# Altium project LHC_Clock.PrjPcb
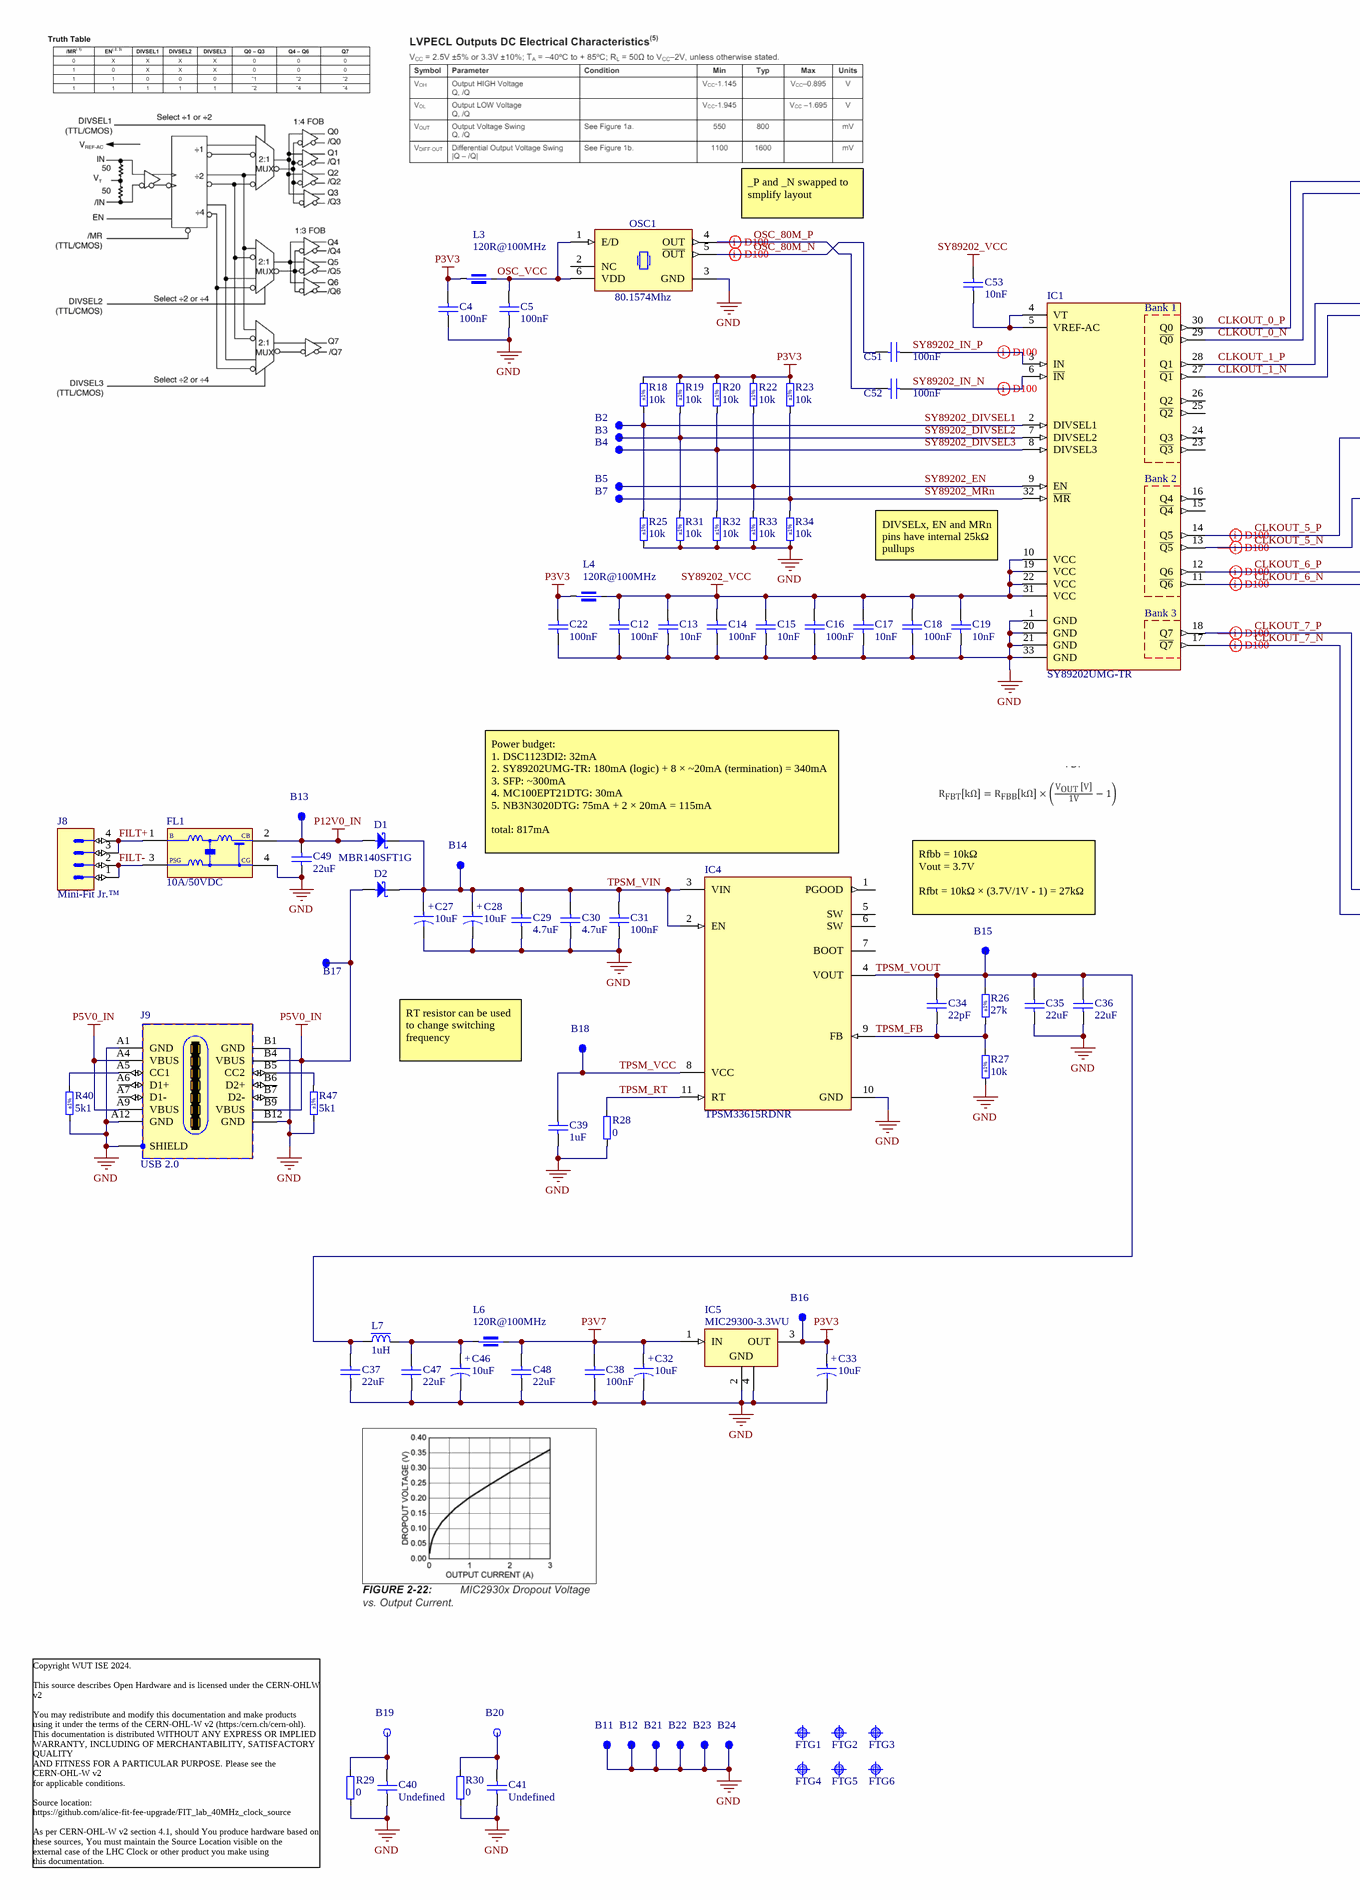
[diagram p0: LHC_Clock.SchDoc, left]
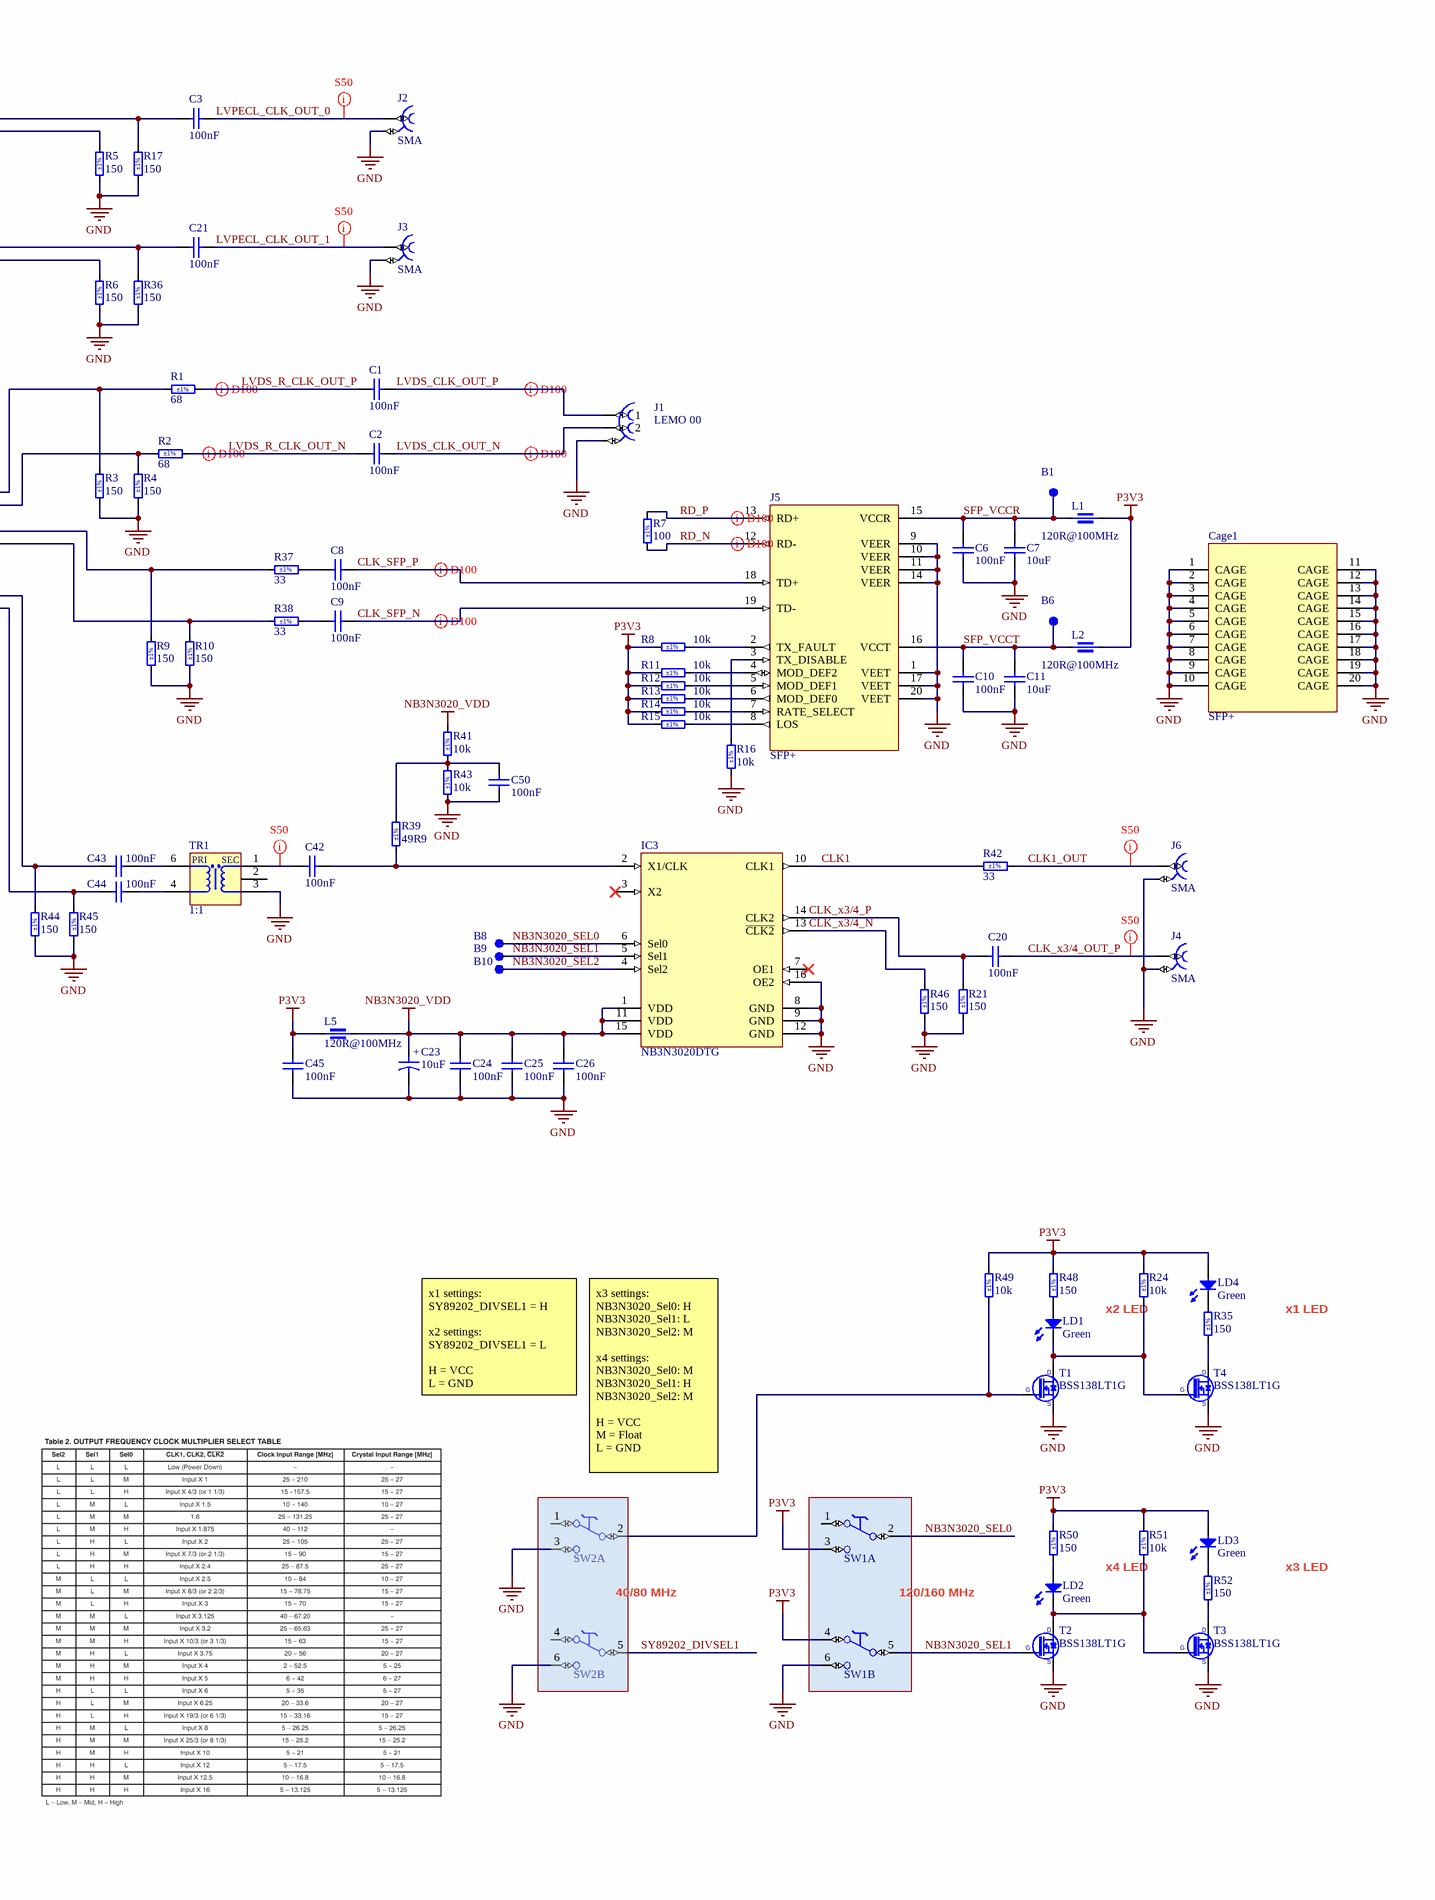
[diagram p1: LHC_Clock.SchDoc, right]
1 sheet, 170 parts. Net scope: global (net labels, ports and power ports of the same name join across sheets).
Board files: LHC_Clock.PcbDoc, PANEL-LHC_Clock.PcbDoc

## Sheet LHC_Clock.SchDoc: LHC clock
size A2; Author: M.Beldyga; CompanyName: WUT ISE; DrawnBy: M.Beldyga; Organization: WUT ISE; Address1: PW ISE; Address2: Nowowiejska 15/19 00-665 Warsaw; Address3: micbeldyga@gmail.com; Revision: 1.0; SheetNumber: 1; SheetTotal: 1; ModifiedBy: -; CheckedDate: -; DivGrp: WUT ISE; Designer: M.Beldyga; ModifiedDate: -; ProjectName: Sensor Box

### Parts
B1  SMD Pad  [C100]  (value not drawn)  (no BOM)
B2  SMD Pad  [C100]  (value not drawn)  (no BOM)
B3  SMD Pad  [C100]  (value not drawn)  (no BOM)
B4  SMD Pad  [C100]  (value not drawn)  (no BOM)
B5  SMD Pad  [C100]  (value not drawn)  (no BOM)
B6  SMD Pad  [C100]  (value not drawn)  (no BOM)
B7  SMD Pad  [C100]  (value not drawn)  (no BOM)
B8  SMD Pad  [C100]  (value not drawn)  (no BOM)
B9  SMD Pad  [C100]  (value not drawn)  (no BOM)
B10  SMD Pad  [C100]  (value not drawn)  (no BOM)
B11  SMD Pad  [C100]  (value not drawn)  (no BOM)
B12  SMD Pad  [C100]  (value not drawn)  (no BOM)
B13  SMD Pad  [C100]  (value not drawn)  (no BOM)
B14  SMD Pad  [C100]  (value not drawn)  (no BOM)
B15  SMD Pad  [C100]  (value not drawn)  (no BOM)
B16  SMD Pad  [C100]  (value not drawn)  (no BOM)
B17  SMD Pad  [C100]  (value not drawn)  (no BOM)
B18  SMD Pad  [C100]  (value not drawn)  (no BOM)
B19  Plated Hole  [MTG270_500]  (value not drawn)  (no BOM)
B20  Plated Hole  [MTG270_500]  (value not drawn)  (no BOM)
B21  SMD Pad  [C100]  (value not drawn)  (no BOM)
B22  SMD Pad  [C100]  (value not drawn)  (no BOM)
B23  SMD Pad  [C100]  (value not drawn)  (no BOM)
B24  SMD Pad  [C100]  (value not drawn)  (no BOM)
C1  100nF  [CAPC1005X55N]
C2  100nF  [CAPC1005X55N]
C3  100nF  [CAPC1005X55N]
C4  100nF  [CAPC1005X55N]
C5  100nF  [CAPC1005X55N]
C6  100nF  [CAPC1005X55N]
C7  10uF  [CAPC1608X80N]
C8  100nF  [CAPC1005X55N]
C9  100nF  [CAPC1005X55N]
C10  100nF  [CAPC1005X55N]
C11  10uF  [CAPC1608X80N]
C12  100nF  [CAPC1005X55N]
C13  10nF  [CAPC1005X55N]
C14  100nF  [CAPC1005X55N]
C15  10nF  [CAPC1005X55N]
C16  100nF  [CAPC1005X55N]
C17  10nF  [CAPC1005X55N]
C18  100nF  [CAPC1005X55N]
C19  10nF  [CAPC1005X55N]
C20  100nF  [CAPC1005X55N]
C21  100nF  [CAPC1005X55N]
C22  100nF  [CAPC1005X55N]
C23  10uF  [CAPMP3216X180N]
C24  100nF  [CAPC1005X55N]
C25  100nF  [CAPC1005X55N]
C26  100nF  [CAPC1005X55N]
C27  10uF  [CAPMP3216X180N]
C28  10uF  [CAPMP3216X180N]
C29  4.7uF  [CAPC1608X90N]
C30  4.7uF  [CAPC1608X90N]
C31  100nF  [CAPC1005X55N]
C32  10uF  [CAPMP3216X180N]
C33  10uF  [CAPMP3216X180N]
C34  22pF  [CAPC1005X55N]
C35  22uF  [CAPC2012X135N]
C36  22uF  [CAPC2012X135N]
C37  22uF  [CAPC2012X135N]
C38  100nF  [CAPC1005X55N]
C39  1uF  [CAPC1608X87N]
C40  Undefined  [CAPC2012X135N]
C41  Undefined  [CAPC2012X135N]
C42  100nF  [CAPC1005X55N]
C43  100nF  [CAPC1005X55N]
C44  100nF  [CAPC1005X55N]
C45  100nF  [CAPC1005X55N]
C46  10uF  [CAPMP3216X180N]
C47  22uF  [CAPC2012X135N]
C48  22uF  [CAPC2012X135N]
C49  22uF  [CAPC2012X135N]
C50  100nF  [CAPC1005X55N]
C51  100nF  [CAPC1005X55N]
C52  100nF  [CAPC1005X55N]
C53  10nF  [CAPC1005X55N]
Cage1  SFP+  [MOLEX_74737-0009]
D1  MBR140SFT1G  [SOD-123FL]
D2  MBR140SFT1G  [SOD-123FL]  (value not drawn)
FL1  10A/50VDC  [FIL_MURATA_BNX02]
FTG1  Use only in PCB  [FIDUCIAL_TOP_S100-200]  (value not drawn)  (no BOM)
FTG2  Use only in PCB  [FIDUCIAL_TOP_S100-200]  (value not drawn)  (no BOM)
FTG3  Use only in PCB  [FIDUCIAL_TOP_S100-200]  (value not drawn)  (no BOM)
FTG4  Use only in PCB  [FIDUCIAL_TOP_S100-200]  (value not drawn)  (no BOM)
FTG5  Use only in PCB  [FIDUCIAL_TOP_S100-200]  (value not drawn)  (no BOM)
FTG6  Use only in PCB  [FIDUCIAL_TOP_S100-200]  (value not drawn)  (no BOM)
IC1  SY89202UMG-TR  [QFN50P500X500X90_HS-33N]
IC3  NB3N3020DTG  [TSOP65P640X120-16N]
IC4  TPSM33615RDNR  [RDN0011A-MFG]
IC5  MIC29300-3.3WU  [TO254P1524X460-4N-S769X1066]
J1  LEMO 00  [LEMO_EPG.00.302.NLN]
J2  SMA  [AMPHENOL_132203-12]
J3  SMA  [MOLEX_73251-2120]
J4  SMA  [AMPHENOL_132203-12]
J5  SFP+  [MOLEX_74441-0001]
J6  SMA  [MOLEX_73251-2120]
J8  Mini-Fit Jr.™  [MOLEX_39-30-0040]
J9  USB 2.0  [MOLEX_216989-0001]
L1  120R@100MHz  [INDC1608X65N]
L2  120R@100MHz  [INDC1608X65N]
L3  120R@100MHz  [INDC1608X65N]
L4  120R@100MHz  [INDC1608X65N]
L5  120R@100MHz  [INDC1608X65N]
L6  120R@100MHz  [INDC1608X65N]
L7  1uH  [IND_COILCRAFT_PFL3215]
LD1  Green  [LED_AVAGO_HSME-C120]
LD2  Green  [LED_AVAGO_HSME-C120]
LD3  Green  [LED_AVAGO_HSME-C120]
LD4  Green  [LED_AVAGO_HSME-C120]
OSC1  80.1574Mhz  [OSC_MICROCHIP_DSC11x3D]
R1  68  Tolerance: ±1%  [RESC1005X40N]
R2  68  Tolerance: ±1%  [RESC1005X40N]
R3  150  Tolerance: ±1%  [RESC1005X40N]
R4  150  Tolerance: ±1%  [RESC1005X40N]
R5  150  Tolerance: ±1%  [RESC1005X40N]
R6  150  Tolerance: ±1%  [RESC1005X40N]
R7  100  Tolerance: ±1%  [RESC1005X40N]
R8  10k  Tolerance: ±1%  [RESC1005X40N]
R9  150  Tolerance: ±1%  [RESC1005X40N]
R10  150  Tolerance: ±1%  [RESC1005X40N]
R11  10k  Tolerance: ±1%  [RESC1005X40N]
R12  10k  Tolerance: ±1%  [RESC1005X40N]
R13  10k  Tolerance: ±1%  [RESC1005X40N]
R14  10k  Tolerance: ±1%  [RESC1005X40N]
R15  10k  Tolerance: ±1%  [RESC1005X40N]
R16  10k  Tolerance: ±1%  [RESC1005X40N]
R17  150  Tolerance: ±1%  [RESC1005X40N]
R18  10k  Tolerance: ±1%  [RESC1005X40N]
R19  10k  Tolerance: ±1%  [RESC1005X40N]
R20  10k  Tolerance: ±1%  [RESC1005X40N]
R21  150  Tolerance: ±1%  [RESC1005X40N]
R22  10k  Tolerance: ±1%  [RESC1005X40N]
R23  10k  Tolerance: ±1%  [RESC1005X40N]
R24  10k  Tolerance: ±1%  [RESC1005X40N]
R25  10k  Tolerance: ±1%  [RESC1005X40N]
R26  27k  Tolerance: ±1%  [RESC1005X40N]
R27  10k  Tolerance: ±1%  [RESC1005X40N]
R28  0  [RESC1005X40N]
R29  0  [RESC1608X55N]
R30  0  [RESC1608X55N]
R31  10k  Tolerance: ±1%  [RESC1005X40N]
R32  10k  Tolerance: ±1%  [RESC1005X40N]
R33  10k  Tolerance: ±1%  [RESC1005X40N]
R34  10k  Tolerance: ±1%  [RESC1005X40N]
R35  150  Tolerance: ±1%  [RESC1005X40N]
R36  150  Tolerance: ±1%  [RESC1005X40N]
R37  33  Tolerance: ±1%  [RESC1005X40N]
R38  33  Tolerance: ±1%  [RESC1005X40N]
R39  49R9  Tolerance: ±1%  [RESC1005X40N]
R40  5k1  Tolerance: ±1%  [RESC1005X40N]
R41  10k  Tolerance: ±1%  [RESC1005X40N]
R42  33  Tolerance: ±1%  [RESC1005X40N]
R43  10k  Tolerance: ±1%  [RESC1005X40N]
R44  150  Tolerance: ±1%  [RESC1005X40N]
R45  150  Tolerance: ±1%  [RESC1005X40N]
R46  150  Tolerance: ±1%  [RESC1005X40N]
R47  5k1  Tolerance: ±1%  [RESC1005X40N]
R48  150  Tolerance: ±1%  [RESC1005X40N]
R49  10k  Tolerance: ±1%  [RESC1005X40N]
R50  150  Tolerance: ±1%  [RESC1005X40N]
R51  10k  Tolerance: ±1%  [RESC1005X40N]
R52  150  Tolerance: ±1%  [RESC1005X40N]
SW1  Switch  [SW_C&K_JS202011CQN]  (value not drawn)  (parts A,B of 2)
SW2  Switch  [SW_C&K_JS202011CQN]  (value not drawn)  (parts A,B of 2)
T1  BSS138LT1G  [SOT95P240X110-3N]
T2  BSS138LT1G  [SOT95P240X110-3N]
T3  BSS138LT1G  [SOT95P240X110-3N]
T4  BSS138LT1G  [SOT95P240X110-3N]
TR1  1:1  [XFMR_MINI-CIRCUITS_AT224-1]

### Blocks framed on the sheet
40/80 MHz: SW2
120/160 MHz: SW1

### Nets
GND: B11.1 B12.1 B21.1 B22.1 B23.1 B24.1 C4.1 C5.1 C6.2 C7.1 C10.2 C11.1 C12.1 C13.1 C14.1 C15.1 C16.1 C17.1 C18.1 C19.1 C22.1 C23.2 C24.1 C25.1 C26.1 C27.2 C28.2 C29.1 C30.1 C31.1 C32.2 C33.2 C35.1 C36.1 C37.1 C38.1 C39.1 C40.2 C41.2 C45.1 C46.2 C47.1 C48.1 C49.1 C50.1 Cage1.1(CAGE) Cage1.2(CAGE) Cage1.3(CAGE) Cage1.4(CAGE) Cage1.5(CAGE) Cage1.6(CAGE) Cage1.7(CAGE) Cage1.8(CAGE) Cage1.9(CAGE) Cage1.10(CAGE) Cage1.11(CAGE) Cage1.12(CAGE) Cage1.13(CAGE) Cage1.14(CAGE) Cage1.15(CAGE) Cage1.16(CAGE) Cage1.17(CAGE) Cage1.18(CAGE) Cage1.19(CAGE) Cage1.20(CAGE) FL1.4(CG) IC1.1(GND) IC1.20(GND) IC1.21(GND) IC1.33(GND) IC3.8(GND) IC3.9(GND) IC3.12(GND) IC3.16(OE2) IC4.10(GND) IC5.2(GND) IC5.4(GND) J1.3 J2.2 J3.2 J4.2 J5.1(VEET) J5.9(VEER) J5.10(VEER) J5.11(VEER) J5.14(VEER) J5.17(VEET) J5.20(VEET) J6.2 J9.A1(GND) J9.A12(GND) J9.B1(GND) J9.B12(GND) J9.SHIELD OSC1.3(GND) R3.1 R4.1 R5.1 R6.1 R9.1 R10.1 R16.1 R17.1 R21.1 R25.2 R27.2 R28.1 R29.2 R30.2 R31.2 R32.2 R33.2 R34.2 R36.1 R40.1 R43.1 R44.1 R45.1 R46.1 R47.1 SW1.6(NO) SW2.3(NO) SW2.6(NO) T1.2(S) T2.2(S) T3.2(S) T4.2(S) TR1.3(S)
NB3N3020_VDD: C23.1 C24.2 C25.2 C26.2 IC3.1(VDD) IC3.11(VDD) IC3.15(VDD) L5.2 R41.2
P3V3: B16.1 C4.2 C22.2 C33.1 C45.2 IC5.3(OUT) L1.2 L2.2 L3.1 L4.1 L5.1 LD3.2(A) LD4.2(A) R8.2 R11.2 R12.2 R13.2 R14.2 R15.2 R18.1 R19.1 R20.1 R22.1 R23.1 R24.2 R48.2 R49.2 R50.2 R51.2 SW1.3(NO) SW1.4(NC)
P3V7: C32.1 C38.2 C48.2 IC5.1(IN) L6.2
P5V0_IN: B17.1 D2.2(A) J9.A4(VBUS) J9.A9(VBUS) J9.B4(VBUS) J9.B9(VBUS)
P12V0_IN: B13.1 C49.2 D1.2(A) FL1.2(CB)
SY89202_VCC: C12.2 C13.2 C14.2 C15.2 C16.2 C17.2 C18.2 C19.2 C53.2 IC1.10(VCC) IC1.19(VCC) IC1.22(VCC) IC1.31(VCC) L4.2
CLK1: IC3.10(CLK1) R42.1
CLK1_OUT: J6.1 R42.2
CLK_SFP_N: C9.1 J5.19(TD-)
CLK_SFP_P: C8.2 J5.18(TD+)
CLK_x3/4_N: IC3.13(~{CLK2}) R46.2
CLK_x3/4_OUT_P: C20.2 J4.1
CLK_x3/4_P: C20.1 IC3.14(CLK2) R21.2
CLKOUT_0_N: IC1.29(~{Q0}) R5.2
CLKOUT_0_P: C3.1 IC1.30(Q0) R17.2
CLKOUT_1_N: IC1.27(~{Q1}) R6.2
CLKOUT_1_P: C21.1 IC1.28(Q1) R36.2
CLKOUT_5_N: IC1.13(~{Q5}) R2.1 R4.2
CLKOUT_5_P: IC1.14(Q5) R1.1 R3.2
CLKOUT_6_N: IC1.11(~{Q6}) R10.2 R38.1
CLKOUT_6_P: IC1.12(Q6) R9.2 R37.1
CLKOUT_7_N: C44.1 IC1.17(~{Q7}) R45.2
CLKOUT_7_P: C43.1 IC1.18(Q7) R44.2
FILT+: FL1.1(B) J8.3 J8.4
FILT-: FL1.3(PSG) J8.1 J8.2
LVDS_CLK_OUT_N: C2.1 J1.2
LVDS_CLK_OUT_P: C1.2 J1.1
LVDS_R_CLK_OUT_N: C2.2 R2.2
LVDS_R_CLK_OUT_P: C1.1 R1.2
LVPECL_CLK_OUT_0: C3.2 J2.1
LVPECL_CLK_OUT_1: C21.2 J3.1
NB3N3020_SEL0: B8.1 IC3.6(Sel0) SW1.2(C)
NB3N3020_SEL1: B9.1 IC3.5(Sel1) SW1.5(C) T2.1(G)
NB3N3020_SEL2: B10.1 IC3.4(Sel2)
OSC_80M_N: C51.2 OSC1.5(~{OUT})
OSC_80M_P: C52.2 OSC1.4(OUT)
OSC_VCC: C5.2 L3.2 OSC1.1(E/D) OSC1.6(VDD)
RD_N: J5.12(RD-) R7.2
RD_P: J5.13(RD+) R7.1
SFP_VCCR: B1.1 C6.1 C7.2 J5.15(VCCR) L1.1
SFP_VCCT: B6.1 C10.1 C11.2 J5.16(VCCT) L2.1
SY89202_DIVSEL1: B2.1 IC1.2(DIVSEL1) R18.2 R25.1 SW2.5(C)
SY89202_DIVSEL2: B3.1 IC1.7(DIVSEL2) R19.2 R31.1
SY89202_DIVSEL3: B4.1 IC1.8(DIVSEL3) R20.2 R32.1
SY89202_EN: B5.1 IC1.9(EN) R22.2 R33.1
SY89202_IN_N: C52.1 IC1.6(~{IN})
SY89202_IN_P: C51.1 IC1.3(IN)
SY89202_MRn: B7.1 IC1.32(~{MR}) R23.2 R34.1
TPSM_FB: C34.1 IC4.9(FB) R26.1 R27.1
TPSM_RT: IC4.11(RT) R28.2
TPSM_VCC: B18.1 C39.2 IC4.8(VCC)
TPSM_VIN: B14.1 C27.1 C28.1 C29.2 C30.2 C31.2 D1.1(C) D2.1(C) IC4.2(EN) IC4.3(VIN)
TPSM_VOUT: B15.1 C34.2 C35.2 C36.2 C37.2 IC4.4(VOUT) L7.1 R26.2
NetB19_1: B19.1 C40.1 R29.1
NetB20_1: B20.1 C41.1 R30.1
NetC8_1: C8.1 R37.2
NetC9_2: C9.2 R38.2
NetC42_1: C42.1 TR1.1(SDOT)
NetC42_2: C42.2 IC3.2(X1/CLK) R39.1
NetC43_2: C43.2 TR1.6(PDOT)
NetC44_2: C44.2 TR1.4(P)
NetC46_1: C46.1 C47.2 L6.1 L7.2
NetC50_2: C50.2 R39.2 R41.1 R43.2
NetC53_1: C53.1 IC1.4(VT) IC1.5(VREF-AC)
NetJ5_2: J5.2(TX_FAULT) R8.1
NetJ5_3: J5.3(TX_DISABLE) R16.2
NetJ5_4: J5.4(MOD_DEF2) R11.1
NetJ5_5: J5.5(MOD_DEF1) R12.1
NetJ5_6: J5.6(MOD_DEF0) R13.1
NetJ5_7: J5.7(RATE_SELECT) R14.1
NetJ5_8: J5.8(LOS) R15.1
NetJ9_A5: J9.A5(CC1) R40.2
NetJ9_B5: J9.B5(CC2) R47.2
NetLD1_1: LD1.1(C) R24.1 T1.3(D) T4.1(G)
NetLD1_2: LD1.2(A) R48.1
NetLD2_1: LD2.1(C) R51.1 T2.3(D) T3.1(G)
NetLD2_2: LD2.2(A) R50.1
NetLD3_1: LD3.1(C) R52.2
NetLD4_1: LD4.1(C) R35.2
NetR35_1: R35.1 T4.3(D)
NetR49_1: R49.1 SW2.2(C) T1.1(G)
NetR52_1: R52.1 T3.3(D)

Not connected (* = marked no-connect by the designer): IC1 15(~{Q4}) 16(Q4) 23(~{Q3}) 24(Q3) 25(~{Q2}) 26(Q2); IC3 3(X2)* 7(OE1)*; IC4 1(PGOOD) 5(SW) 6(SW) 7(BOOT); J9 A6(D1+) A7(D1-) B6(D2+) B7(D2-); OSC1 2(NC); SW1 1(NC); SW2 1(NC) 4(NC); TR1 2(NU)

### Layout directives
differential pair; net class D100: CLK_SFP_N, CLK_SFP_P, CLKOUT_5_N, CLKOUT_5_P, CLKOUT_6_N, CLKOUT_6_P, CLKOUT_7_N, CLKOUT_7_P, LVDS_CLK_OUT_N, LVDS_CLK_OUT_P, LVDS_R_CLK_OUT_N, LVDS_R_CLK_OUT_P, OSC_80M_N, OSC_80M_P, RD_N, RD_P, SY89202_IN_N, SY89202_IN_P
net class S50: CLK1_OUT, CLK_x3/4_OUT_P, LVPECL_CLK_OUT_0, LVPECL_CLK_OUT_1, NetC42_1

### Notes on the sheet
- _P and _N swapped to smplify layout
- DIVSELx, EN and MRn pins have internal 25kΩ pullups
- Power budget:
  1. DSC1123DI2: 32mA
  2. SY89202UMG-TR: 180mA (logic) + 8 × ~20mA (termination) = 340mA
  3. SFP: ~300mA
  4. MC100EPT21DTG: 30mA
  5. NB3N3020DTG: 75mA + 2 × 20mA = 115mA
  total: 817mA
- (near B15) Rfbb = 10kΩ
  Vout = 3.7V
  Rfbt = 10kΩ × (3.7V/1V - 1) = 27kΩ
- RT resistor can be used to change switching frequency
- x2 LED
- x1 LED
- x1 settings:
  SY89202_DIVSEL1 = H
  x2 settings:
  SY89202_DIVSEL1 = L
  H = VCC
  L = GND
- x3 settings:
  NB3N3020_Sel0: H
  NB3N3020_Sel1: L
  NB3N3020_Sel2: M
  x4 settings:
  NB3N3020_Sel0: M
  NB3N3020_Sel1: H
  NB3N3020_Sel2: M
  H = VCC
  M = Float
  L = GND
- x4 LED
- x3 LED
- (near R29) Copyright WUT ISE 2024.
  This source describes Open Hardware and is licensed under the CERN-OHLW v2
  You may redistribute and modify this documentation and make products
  using it under the terms of the CERN-OHL-W v2 (https:/cern.ch/cern-ohl).
  This documentation is distributed WITHOUT ANY EXPRESS OR IMPLIED
  WARRANTY, INCLUDING OF MERCHANTABILITY, SATISFACTORY QUALITY
  AND FITNESS FOR A PARTICULAR PURPOSE. Please see the CERN-OHL-W v2
  for applicable conditions.
  Source location: https://github.com/alice-fit-fee-upgrade/FIT_lab_40MHz_clock_source
  As per CERN-OHL-W v2 section 4.1, should You produce hardware based on
  these sources, You must maintain the Source Location visible on the
  external case of the LHC Clock or other product you make using
  this documentation.
- Project/Equipment
- Document
- Designer
- Drawn by
- Check.by
- Last Mod.
- Contact
- File
- Print Date
- Sheet
- Size
- A2
- of
- Rev
- (in symbol CTE3216-18_10UF_16V_20%_AVX_TCJ) +
- (in symbol SY89202UMG-TR) Bank 1; Bank 2; Bank 3
- (in symbol XFMR_MINI-CIRCUITS_TC1-1+) PRI; SEC

### Library data of the parts
B1-B18 B21-B24 = SMD_PAD_D1MM: Pad; Part Description: 1mm Diameter SMD Pad; Mounted: No; Part Number: SMD_PAD_D1MM; Component Type: Standard (No BOM); Pin Count: 1; Family: SMD Pad; Socket: No; SMD: Yes; Sense: No; Status: None; ComponentHeight: 0mm; HelpURL: Undefined; Author: CERN DEM JLC; CreateDate: 10/10/2017; LatestRevisionDate: 10/10/2017; PackageDescription: 1mm Diameter SMD Pad
B19 B20 = PLATED_HOLE2.7_PAD5.0: Single Terminal Socket; Part Description: Plated Through Hole: Hole Dia.=2.7mm Pad Dia.=5.0mm; Mounted: No; Part Number: PLATED_HOLE2.7_PAD5.0; Component Type: Standard (No BOM); Pin Count: 1; Family: Plated Hole; Socket: No; SMD: No; Sense: No; Status: None; ComponentHeight: 0mm; HelpURL: Undefined; Author: CERN DEM JMW; CreateDate: 9/27/2011; LatestRevisionDate: 9/27/2011; PackageDescription: Plated Through Hole: Hole Dia.=2.7mm Pad Dia.=5.0mm
C1-C6 C8-C10 C12 C14 C16 C18 C20-C22 C24-C26 C31 C38 C42-C45 C50-C52 = CC0402_100NF_50V_10%_X7R: Non-polarised capacitor; Part Description: SMD Multilayer Chip Ceramic Capacitor; Manufacturer: GENERIC; Manufacturer1 Part Number: GRM155R71H104KE14D; Voltage: 50V; TC: X7R; Tolerance: ±10%; Part Number: CC0402_100NF_50V_10%_X7R; Component Kind: Standard; Component Type: Standard; Pin Count: 2; Value: 100nF; Status: None; Manufacturer Part Number: CC0402_100NF_50V_10%_X7R; Case: 0402; Mounted: Yes; Socket: No; SMD: Yes; Sense: No; Manufacturer1 Example: MURATA; Manufacturer1 ComponentHeight: 0.55mm; HelpURL: \\cern.ch\dfs\Applications\Altium\Datasheets\CC0402_MURATA_GRM155R71H104KE14D.pdf; Author: CERN DEM MR; CreateDate: 6/30/2017; LatestRevisionDate: 6/30/2017
C7 C11 = CC0603_10UF_16V_20%_X5R: Non-polarised capacitor; Part Description: SMD Multilayer Chip Ceramic Capacitor; Manufacturer: GENERIC; Manufacturer1 Part Number: GRM188R61C106MA73D; Voltage: 16V; TC: X5R; Tolerance: ±20%; Part Number: CC0603_10UF_16V_20%_X5R; Component Kind: Standard; Component Type: Standard; Pin Count: 2; Value: 10uF; Status: None; Manufacturer Part Number: CC0603_10UF_16V_20%_X5R; Case: 0603; Mounted: Yes; Socket: No; SMD: Yes; Sense: No; Manufacturer1 Example: MURATA; Manufacturer1 ComponentHeight: 0.8mm; HelpURL: \\cern.ch\dfs\Applications\Altium\Datasheets\CC0603_X5R_MURATA_GRM.pdf; Author: CERN DEM MR; CreateDate: 3/2/2016; LatestRevisionDate: 3/2/2016
C13 C15 C17 C19 C53 = CC0402_10NF_50V_10%_X7R: Non-polarised capacitor; Part Description: SMD Multilayer Chip Ceramic Capacitor; Manufacturer: GENERIC; Manufacturer1 Part Number: GRM155R71H103KA88D; Voltage: 50V; TC: X7R; Tolerance: ±10%; Part Number: CC0402_10NF_50V_10%_X7R; Component Kind: Standard; Component Type: Standard; Pin Count: 2; Value: 10nF; Status: None; Manufacturer Part Number: CC0402_10NF_50V_10%_X7R; Case: 0402; Mounted: Yes; Socket: No; SMD: Yes; Sense: No; Manufacturer1 Example: MURATA; Manufacturer1 ComponentHeight: 0.55mm; HelpURL: \\cern.ch\dfs\Applications\Altium\Datasheets\CC0402_X7R_MURATA_GRM.pdf; Author: CERN DEM MR; CreateDate: 1/8/2016; LatestRevisionDate: 1/8/2016
C23 C27 C28 C32 C33 C46 = CTE3216-18_10UF_16V_20%_AVX_TCJ: Polarised capacitor; Part Description: ESR 0R200 Tantalum Solid Electrolytic Chip Capacitor with Conductive Polymer Electrode; Manufacturer: AVX; Manufacturer Part Number: TCJA106M016R0200; Voltage: 16V; Tolerance: ±20%; Part Number: CTE3216-18_10UF_16V_20%_AVX_TCJ; Component Kind: Standard; Component Type: Standard; Pin Count: 2; Value: 10uF; Status: Preferred; Case: A; Mounted: Yes; Socket: No; SMD: Yes; Sense: No; ComponentHeight: 1.8mm; HelpURL: \\cern.ch\dfs\Applications\Altium\Datasheets\CTE_AVX_TCJ.pdf; Author: CERN DEM JLC; CreateDate: 3/29/2012; LatestRevisionDate: 3/29/2012
C29 C30 = CC0603_4.7UF_25V_10%_X5R: Non-polarised capacitor; Part Description: SMD Multilayer Chip Ceramic Capacitor; Manufacturer: GENERIC; Manufacturer1 Part Number: GRM188R61E475KE11D; Voltage: 25V; TC: X5R; Tolerance: ±10%; Part Number: CC0603_4.7UF_25V_10%_X5R; Component Kind: Standard; Component Type: Standard; Pin Count: 2; Value: 4.7uF; Status: None; Manufacturer Part Number: CC0603_4.7UF_25V_10%_X5R; Case: 0603; Mounted: Yes; Socket: No; SMD: Yes; Sense: No; Manufacturer1 Example: MURATA; Manufacturer1 ComponentHeight: 0.95mm; HelpURL: \\cern.ch\dfs\Applications\Altium\Datasheets\CC0603_MURATA_GRM188R61E475KE11D.pdf; Author: CERN DEM JLC; CreateDate: 11/10/2014; LatestRevisionDate: 11/10/2014
C34 = CC0402_22PF_50V_5%_C0G: Non-polarised capacitor; Part Description: SMD Multilayer Chip Ceramic Capacitor; Manufacturer: GENERIC; Manufacturer1 Part Number: C0402C220J5GACTU; Voltage: 50V; TC: C0G/NP0; Tolerance: ±5%; Part Number: CC0402_22PF_50V_5%_C0G; Component Kind: Standard; Component Type: Standard; Pin Count: 2; Value: 22pF; Status: Preferred; Manufacturer Part Number: CC0402_22PF_50V_5%_C0G; Case: 0402; Mounted: Yes; Socket: No; SMD: Yes; Sense: No; Manufacturer1 Example: KEMET; Manufacturer1 ComponentHeight: 0.55mm; HelpURL: \\cern.ch\dfs\Applications\Altium\Datasheets\CC0402_C0G_KEMET_(Commercial Grade).pdf; Author: CERN DEM JLC; CreateDate: 12/3/2007; LatestRevisionDate: 12/3/2007
C35-C37 C47-C49 = CC0805_22UF_16V_10%_X5R: Non-polarised capacitor; Part Description: SMD Multilayer Chip Ceramic Capacitor; Manufacturer: GENERIC; Manufacturer1 Part Number: C2012X5R1C226KT; Voltage: 16V; TC: X5R; Tolerance: ±10%; Part Number: CC0805_22UF_16V_10%_X5R; Component Kind: Standard; Component Type: Standard; Pin Count: 2; Value: 22uF; Status: Preferred; Manufacturer Part Number: CC0805_22UF_16V_10%_X5R; Case: 0805; Mounted: Yes; Socket: No; SMD: Yes; Sense: No; Manufacturer1 Example: TDK; Manufacturer1 ComponentHeight: 1.35mm; HelpURL: \\cern.ch\dfs\Applications\Altium\Datasheets\CC0805_X5R_TDK_C.pdf; Author: CERN DEM JLC; CreateDate: 10/25/2012; LatestRevisionDate: 10/25/2012
C39 = CC0603_1UF_16V_10%_X7R: Non-polarised capacitor; Part Description: SMD Multilayer Chip Ceramic Capacitor; Manufacturer: GENERIC; Manufacturer1 Part Number: 223878615663; Voltage: 16V; TC: X7R; Tolerance: ±10%; Part Number: CC0603_1UF_16V_10%_X7R; Component Kind: Standard; Component Type: Standard; Pin Count: 2; Value: 1uF; Status: None; Manufacturer Part Number: CC0603_1UF_16V_10%_X7R; Case: 0603; Mounted: Yes; Socket: No; SMD: Yes; Sense: No; Manufacturer1 Example: YAGEO PHYCOMP; Manufacturer1 ComponentHeight: 0.9mm; HelpURL: \\cern.ch\dfs\Applications\Altium\Datasheets\CC0603_X7R_PHYCOMP.pdf; Author: CERN DEM JLC; CreateDate: 12/3/2007; LatestRevisionDate: 4/17/2015
C40 C41 = CC0805_NO-VALUE: Non-polarised capacitor; Part Description: Reserved Footprint For 0805(2012) Chip Ceramic Capacitor; Mounted: No; Part Number: CC0805_NO-VALUE; Component Kind: Standard; Component Type: Standard; Pin Count: 2; Value: Undefined; Status: None; Manufacturer: Undefined; Manufacturer Part Number: CC0805_NO-VALUE; Case: 0805; Socket: No; SMD: Yes; Sense: No; Manufacturer1 ComponentHeight: 1.35mm; HelpURL: Undefined; Author: CERN DEM JLC; CreateDate: 12/10/2008; LatestRevisionDate: 9/11/2013
Cage1 = MOLEX_74737-0009: SFP+ 1x1 Cage (20Pins); Part Description: 1x1 Press Fit Cage for Use with SFP Connector (Small Form-factor Pluggable); Manufacturer: MOLEX; Part Number: MOLEX_74737-0009; Component Kind: Standard; Component Type: Standard; Pin Count: 20; Family: SFP+; Mounted: Yes; Socket: No; SMD: No; PressFit: Yes; Sense: No; Status: None; Manufacturer Part Number: 74737-0009; ComponentHeight: 9.7mm; HelpURL: \\cern.ch\dfs\Applications\Altium\Datasheets\MOLEX_74737-0009.pdf; Author: CERN DEM MR; CreateDate: 1/26/2016; LatestRevisionDate: 1/26/2016
D1 D2 = MBR140SFT1G: Schottky Diode; Part Description: Schottky Power Rectifier; Manufacturer: ON SEMICONDUCTOR; Voltage: 40V; Power: 1A; PressFit: No; Bonding: No; Part Number: MBR140SFT1G; Component Kind: Standard; Component Type: Standard; Device: MBR140SFT1G; PackageDescription: Small Outline Diode Flat Lead (SOD-123FL), Body; 2.70mm L X 1.65mm W X 1.0mm H; Manufacturer Part Number: MBR140SF; Pin Count: 2; Case: SOD-123FL; Mounted: Yes; Socket: No; SMD: Yes; Sense: No; ComponentHeight: 1.0mm; HelpURL: \\cern.ch\dfs\Applications\Altium\Datasheets\MBR140SFT1G.pdf; Author: CERN DEM JLC; CreateDate: 4/6/2009; LatestRevisionDate: 5/24/2022
FL1 = FIL_MURATA_BNX022-01L: Block Type EMIFIL (LC Combined); Part Description: Block Type EMIFIL (LC Combined) SMD Type, BNX02* Series; Manufacturer: MURATA; Resistance: 0.5R; Part Number: FIL_MURATA_BNX022-01L; Component Kind: Standard; Component Type: Standard; Pin Count: 2; Value: 10A/50VDC; Manufacturer Part Number: BNX022-01L; Mounted: Yes; Socket: No; SMD: Yes; Sense: No; ComponentHeight: 3.3mm; HelpURL: \\cern.ch\dfs\Applications\Altium\Datasheets\FIL_MURATA_BNX022-01L.pdf; Author: CERN DEM JLC; CreateDate: 10/10/2012; LatestRevisionDate: 10/10/2012
FTG1-FTG6 = FIDUCIAL_TARGET_S100-200: Fiducial Target; Part Description: Square Fiducial Target, Top Layer, 1.0mm, Top Solder 2.0mm, Keepout =2.0mm; Mounted: No; Part Number: FIDUCIAL_TARGET_S100-200; Component Type: Standard (No BOM); Pin Count: 1; Family: Fiducial; Socket: No; SMD: Yes; Sense: No; Status: None; ComponentHeight: 0mm; HelpURL: Undefined; Author: CERN DEM JLC; CreateDate: 2/9/2010; LatestRevisionDate: 4/4/2012; PackageDescription: Square Fiducial Target, Top Layer, 1.0mm, Top Solder 2.0mm, Keepout =2.0mm
IC1 = SY89202UMG-TR: 1: 8 LVPECL fanout w/ Divide by 1, 2, 4 Dividers 32 VQFN 5x5x0.9mm T/R RoHS Compliant: Yes; Manufacturer: Microchip; Number of Circuits: 1; Clock Frequency: 1.5GHz; Input: CML; Min Supply Voltage: 2.375V; Max Supply Voltage: 3.6V; Number of Outputs: 8; Mode of Operation: DIFFERENTIAL; Supplier: Mouser; Supplier Part Number: 998-SY89202UMGTR; Manufacturer Part Number: SY89202UMG-TR; RoHS: Yes; Category: Clock Buffers, Drivers; Stock: 700; Pricing: 1=10.11, 10=10.07, 50=9.57, 100=9.38, 1000=9.37, 10000=9.37 (USD); Mounting Technology: Surface Mount; Case/Package: QFN; Pins: 32; Min Operating Temperature: -40°C; Max Operating Temperature: 85°C; Packaging: Tape and Reel; Series: Precision Edge®; Package Quantity: 1000; Radiation Hardening: No; Lead Free: Lead Free; RoHS Compliant: Yes; ComponentLink1URL: https://datasheet.ciiva.com/6675/sy89202u-6675296.pdf?src-supplier=Digikey; ComponentLink1Description: https://datasheet.ciiva.com/6675/sy89202u-6675296.pdf?src-supplier=Digikey
IC3 = NB3N3020DTG: Clock Generator 2MHz to 210MHz Input 210MHz Output 16-Pin TSSOP Tube; Manufacturer: ON Semiconductor; Supplier: Digikey; Supplier Part Number: NB3N3020DTGOS-ND; Manufacturer Part Number: NB3N3020DTG; RoHS: Yes; Category: Clock Generators, PLLs, Frequency Synthesizers; Stock: 1304; Pricing: 1=10.69, 10=9.654, 96=7.9925, 288=7.63326, 576=6.95974, 1056=6.06171 (USD); ComponentLink1URL: https://datasheet.ciiva.com/12072/nb3n3020-d-112477-12072970.pdf?src-supplier=Mouser; ComponentLink1Description: https://datasheet.ciiva.com/12072/nb3n3020-d-112477-12072970.pdf?src-supplier=Mouser; ComponentLink2URL: https://datasheet.ciiva.com/15153/getdatasheetpartid-556163-15153893.pdf?src-supplier=Verical; ComponentLink2Description: https://datasheet.ciiva.com/15153/getdatasheetpartid-556163-15153893.pdf?src-supplier=Verical
IC4 = TPSM33615RDNR: 3-V to 36-V input, 1 to 15-V output, 1.5-A synchronous buck power module 11-QFN-FCMOD -40 to 125; Manufacturer: Texas Instruments; Supplier: Mouser; Supplier Part Number: 595-TPSM33615RDNR; Manufacturer Part Number: TPSM33615RDNR; RoHS: No; Stock: 2348; Pricing: 1=3.47, 10=3.12, 50=3.12, 100=2.56, 1000=1.87, 10000=1.58 (USD); Pins: 11NUMBER
IC5 = MIC29300-3.3WU: 3-Terminal Regulator 1=IN 2=GND 3=OUT 4=GND; Part Description: 3.3V, 3A, High-Current Low Dropout Regulator (RoHS); Manufacturer: MICREL; PressFit: No; Bonding: No; Part Number: MIC29300-3.3WU; Component Kind: Standard; Component Type: Standard; Device: MIC29300-3.3WU; PackageDescription: D2PAK TO-263, TO, 2.54mm Pitch; 4 Pin, 15.24mm L X 10.36mm W X 4.597mm H body, IPC Medium Density; Manufacturer Part Number: MIC29300-3.3WU; Pin Count: 4; Case: TO-263-3; Mounted: Yes; Socket: No; SMD: Yes; Sense: No; ComponentHeight: 4.6mm; HelpURL: \\cern.ch\dfs\Applications\Altium\Datasheets\MIC29300-3.3WU.pdf; Author: CERN DEM JLC; CreateDate: 8/22/2011; LatestRevisionDate: 8/8/2012
J1 = LEMO_EPG.00.302.NLN: Part Description: Size 00, Elbow Socket (90°) with 2 Female Contacts and Alignment Key (G); PressFit: No; SCEM: 09.31.28.007.2; Part Number: LEMO_EPG.00.302.NLN; Component Kind: Standard; Component Type: Standard; Pin Count: 3; Family: LEMO 00; Mounted: Yes; Socket: No; SMD: No; Sense: No; Status: None; Manufacturer: LEMO; Manufacturer Part Number: EPG.00.302.NLN; ComponentHeight: 7mm; HelpURL: \\cern.ch\dfs\Applications\Altium\Datasheets\LEMO_EPG.00.302.NLN.pdf; Author: CERN DEM JLC; CreateDate: 8/25/2010; LatestRevisionDate: 12/20/2010
J2 J4 = 132203-12: RF Connector SMA Right Angle PCB Jack Through Hole 50 Ohm Bulkhead; Manufacturer: Amphenol Connex; Supplier: Mouser; Supplier Part Number: 523-132203-12; Manufacturer Part Number: 132203-12; RoHS: Yes; Category: RF / Coaxial Connectors; Stock: 515; Pricing: 1=20.22, 10=18.65, 50=18.65, 100=18.65, 1000=18.65, 10000=18.65 (USD); ComponentLink1URL: https://datasheet.ciiva.com/24241/132203-12-customer-drawing-24241088.pdf?src-supplier=Mouser; ComponentLink1Description: https://datasheet.ciiva.com/24241/132203-12-customer-drawing-24241088.pdf?src-supplier=Mouser; ComponentLink2URL: https://datasheet.ciiva.com/647/132203-12-647032.pdf?src-supplier=Digikey; ComponentLink2Description: https://datasheet.ciiva.com/647/132203-12-647032.pdf?src-supplier=Digikey
J3 J6 = CON_SMA_RA_SMD_73251-2120: 50 Ohm, SMA Edge Mount PCB, With Jam Nut And Lock Washer; Manufacturer: MOLEX; PressFit: No; Part Number: MOLEX_73251-2120; Component Kind: Standard; Component Type: Standard; Pin Count: 5; Family: SMA; Mounted: Yes; Socket: No; SMD: Yes; Sense: No; Status: None; Part Description: 50 Ohm, SMA Edge Mount PCB, With Jam Nut And Lock Washer; Manufacturer Part Number: 73251-2120; ComponentHeight: 5.75mm; HelpURL: \\cern.ch\dfs\Applications\Altium\Datasheets\MOLEX_73251-2121.pdf; Author: CERN DEM JLC; CreateDate: 26.10.2016; LatestRevisionDate: 26.10.2016
J5 = MOLEX_74441-0001: 20 Position SFP  Connector (Small Form-factor Pluggable); Part Description: 20 Position, Pitch 0.8mm SFP Receptacle (Small Form-factor Pluggable); Manufacturer: MOLEX; PressFit: No; Part Number: MOLEX_74441-0001; Component Kind: Standard; Component Type: Standard; Pin Count: 20; Family: SFP+; Mounted: Yes; Socket: No; SMD: Yes; Sense: No; Status: None; Manufacturer Part Number: 74441-0001; ComponentHeight: 5.4mm; HelpURL: \\cern.ch\dfs\Applications\Altium\Datasheets\MOLEX_74441-0001.pdf; ComponentLink1URL: \\cern.ch\dfs\Applications\Altium\Datasheets\MOLEX_SFP_Application.pdf; ComponentLink1Description: Application; Author: CERN DEM MR; CreateDate: 12/3/2015; LatestRevisionDate: 12/3/2015
J8 = MOLEX_39-30-0040: Connector 4 Male; Part Description: 4.20mm (.165") Pitch Mini-Fit Jr. Header, Dual Row, Right Angle with Snap-in Plastic Peg PCB Lock, 4 Circuits; Manufacturer: MOLEX; PressFit: No; Part Number: MOLEX_39-30-0040; Component Kind: Standard; Component Type: Standard; Pin Count: 4; Family: Mini-Fit Jr.™; Mounted: Yes; Socket: No; SMD: No; Sense: No; Status: None; Manufacturer Part Number: 39-30-0040; ComponentHeight: 11.4mm; HelpURL: \\cern.ch\dfs\Applications\Altium\Datasheets\MOLEX_39-30-0040.pdf; Author: CERN DEM JLC; CreateDate: 10/2/2018; LatestRevisionDate: 10/2/2018
J9 = MOLEX_216989-0001: 2x7 Pin + 1 Shield  USB Type C Receptacle; Part Description: USB 2.0 Type C Receptacle, High Temp., Flag Style Through Hole 14 Pin; Manufacturer: MOLEX; PressFit: No; Part Number: MOLEX_216989-0001; Component Kind: Standard; Component Type: Standard; Pin Count: 18; Family: USB 2.0; Mounted: Yes; Socket: No; SMD: No; Sense: No; Status: None; Manufacturer Part Number: 216989-0001; ComponentHeight: 8.94mm; HelpURL: \\cern.ch\dfs\Applications\Altium\Datasheets\MOLEX_216989-0001.pdf; Author: CERN DEM HF; CreateDate: 9/30/2022; LatestRevisionDate: 9/30/2022
L1-L6 = IND0603_MURATA_BLM18SG121TN1D: Part Description: SMD EMIFIL Suppression Chip Ferrite Bead; Manufacturer: MURATA; Power: 3A; Resistance: 0.025R; Tolerance: ±25%; Part Number: IND0603_MURATA_BLM18SG121TN1D; Component Kind: Standard; Component Type: Standard; Pin Count: 2; Value: 120R@100MHz; Manufacturer Part Number: BLM18SG121TN1D; Case: 0603; Mounted: Yes; Socket: No; SMD: Yes; Sense: No; ComponentHeight: 0.65mm; HelpURL: \\cern.ch\dfs\Applications\Altium\Datasheets\IND0603_MURATA_BLM18S.pdf; Author: CERN DEM JLC; CreateDate: 7/23/2014; LatestRevisionDate: 10/25/2018
L7 = IND_1UH_20%_COILCRAFT_PFL3215: Inductor With Core; Part Description: SMD Shielded Power Inductor; Manufacturer Part Number: PFL3215-102MEB; Power: 1.9A; Resistance: 0.038R; Tolerance: ±20%; Part Number: IND_1UH_20%_COILCRAFT_PFL3215; Component Kind: Standard; Component Type: Standard; Pin Count: 2; Value: 1uH; Manufacturer: COILCRAFT; Mounted: Yes; Socket: No; SMD: Yes; Sense: No; ComponentHeight: 1.5mm; HelpURL: \\cern.ch\dfs\Applications\Altium\Datasheets\IND_COILCRAFT_PFL3215.pdf; Author: CERN DEM MR; CreateDate: 3/14/2016; LatestRevisionDate: 3/14/2016
LD1-LD4 = LED_AVAGO_HSME-C120: LED Green 1C 2A; Part Description: High Performance Right Angle Chip Green LED; Manufacturer: AVAGO TECHNOLOGIES; PressFit: No; Bonding: No; Part Number: LED_AVAGO_HSME-C120; Component Kind: Standard; Component Type: Standard; Color: Green; PackageDescription: Green Chip LED, 2-Leads, Body 1.7x1.1mm, Side Emitting Package; Manufacturer Part Number: HSME-C120; Pin Count: 2; Mounted: Yes; Socket: No; SMD: Yes; Sense: No; ComponentHeight: 0.7mm; HelpURL: \\cern.ch\dfs\Applications\Altium\Datasheets\LED_AVAGO_HSME-C120.pdf; ComponentLink1URL: \\cern.ch\dfs\Applications\Altium\Datasheets\LED_AVAGO_HSME-C110_DESIGN-GUIDE.pdf; ComponentLink1Description: Design Guide; Author: CERN DEM JMW; CreateDate: 7/22/2009; LatestRevisionDate: 6/20/2012
OSC1 = OSC_80.1574MHZ_MICROCHIP_DSC1123DI2: Low-Jitter Precision LVDS Oscillator (DSC1123 Series); Part Description: 2.25V-3.6V, ±25ppm, -40..85°C, Surface Mount Low-Jitter Precision LVDS Oscillator (DSC11x3 Series); Manufacturer: MICROCHIP TECHNOLOGY; Manufacturer Part Number: DSC1123DI2-80.1574; PressFit: No; Bonding: No; Part Number: OSC_80.1574MHZ_MICROCHIP_DSC1123DI2; Component Kind: Standard; Component Type: Standard; PackageDescription: MICROCHIP DSC11x3D Series, SMD Oscillator, DFN, 6 Pins, 2.5mm x 2.0mm; Value: 80.1574Mhz; Pin Count: 6; Mounted: Yes; Socket: No; SMD: Yes; Sense: No; ComponentHeight: 0.9mm; HelpURL: \\cern.ch\dfs\Applications\Altium\Datasheets\OSC_MICROCHIP_DSC11x3.pdf; Author: CERN DEM BC; CreateDate: 2/3/2021; LatestRevisionDate: 2/3/2021
R1 R2 = R0402_68R_1%_0.0625W_100PPM: Resistor - 1%; Part Description: General Purpose Thick Film Chip Resistor; Manufacturer: GENERIC; Manufacturer1 Part Number: 232270676809L; TC: ±100ppm/°C; PressFit: No; Part Number: R0402_68R_1%_0.0625W_100PPM; Component Kind: Standard; Component Type: Standard; Pin Count: 2; Value: 68; Status: Not Recommended; Power: 0.0625W; Manufacturer Part Number: R0402_68R_1%_0.0625W_100PPM; Case: 0402; Mounted: Yes; Sense: No; Socket: No; SMD: Yes; Manufacturer1 Example: YAGEO PHYCOMP; Manufacturer1 ComponentHeight: 0.4mm; HelpURL: \\cern.ch\dfs\Applications\Altium\Datasheets\R0402_Phycomp_RC0402.pdf; Author: CERN DEM JLC; CreateDate: 12/3/2007; LatestRevisionDate: 10/17/2012
R3-R6 R9 R10 R17 R21 R35 R36 R44-R46 R48 R50 R52 = R0402_150R_1%_0.0625W_100PPM: Resistor - 1%; Part Description: General Purpose Thick Film Chip Resistor; Manufacturer: GENERIC; Manufacturer1 Part Number: 232270671501L; TC: ±100ppm/°C; PressFit: No; Part Number: R0402_150R_1%_0.0625W_100PPM; Component Kind: Standard; Component Type: Standard; Pin Count: 2; Value: 150; Status: Not Recommended; Power: 0.0625W; Manufacturer Part Number: R0402_150R_1%_0.0625W_100PPM; Case: 0402; Mounted: Yes; Sense: No; Socket: No; SMD: Yes; Manufacturer1 Example: YAGEO PHYCOMP; Manufacturer1 ComponentHeight: 0.4mm; HelpURL: \\cern.ch\dfs\Applications\Altium\Datasheets\R0402_Phycomp_RC0402.pdf; Author: CERN DEM JLC; CreateDate: 12/3/2007; LatestRevisionDate: 10/17/2012
R7 = R0402_100R_1%_0.1W_100PPM: Resistor - 1%; Part Description: General Purpose Thick Film Chip Resistor; Manufacturer: GENERIC; Manufacturer Part Number: R0402_100R_1%_0.1W_100PPM_50V; Manufacturer1 Part Number: ERJ2RKF1000X; Power: 0.1W; TC: ±100ppm/°C; Voltage: 50V; PressFit: No; Part Number: R0402_100R_1%_0.1W_100PPM; Component Kind: Standard; Component Type: Standard; Pin Count: 2; Value: 100; Status: Not Recommended; Case: 0402; Mounted: Yes; Sense: No; Socket: No; SMD: Yes; Manufacturer1 Example: PANASONIC; Manufacturer1 ComponentHeight: 0.4mm; HelpURL: \\cern.ch\dfs\Applications\Altium\Datasheets\R0402_PANASONIC_ERJ2RK.pdf; Author: CERN DEM JLC; CreateDate: 12/12/2013; LatestRevisionDate: 3/3/2015
R8 R11-R16 R18-R20 R22-R25 R27 R31-R34 R41 R43 R49 R51 = R0402_10K_1%_0.0625W_100PPM: Resistor - 1%; Part Description: General Purpose Thick Film Chip Resistor; Manufacturer: GENERIC; Manufacturer1 Part Number: 232270671003L; TC: ±100ppm/°C; PressFit: No; Part Number: R0402_10K_1%_0.0625W_100PPM; Component Kind: Standard; Component Type: Standard; Pin Count: 2; Value: 10k; Status: Not Recommended; Power: 0.0625W; Manufacturer Part Number: R0402_10K_1%_0.0625W_100PPM; Case: 0402; Mounted: Yes; Sense: No; Socket: No; SMD: Yes; Manufacturer1 Example: YAGEO PHYCOMP; Manufacturer1 ComponentHeight: 0.4mm; HelpURL: \\cern.ch\dfs\Applications\Altium\Datasheets\R0402_Phycomp_RC0402.pdf; Author: CERN DEM JLC; CreateDate: 12/3/2007; LatestRevisionDate: 10/17/2012
R26 = R0402_27K_1%_0.0625W_100PPM: Resistor - 1%; Part Description: General Purpose Thick Film Chip Resistor; Manufacturer: GENERIC; Manufacturer1 Part Number: 232270672703L; TC: ±100ppm/°C; PressFit: No; Part Number: R0402_27K_1%_0.0625W_100PPM; Component Kind: Standard; Component Type: Standard; Pin Count: 2; Value: 27k; Status: Not Recommended; Power: 0.0625W; Manufacturer Part Number: R0402_27K_1%_0.0625W_100PPM; Case: 0402; Mounted: Yes; Sense: No; Socket: No; SMD: Yes; Manufacturer1 Example: YAGEO PHYCOMP; Manufacturer1 ComponentHeight: 0.4mm; HelpURL: \\cern.ch\dfs\Applications\Altium\Datasheets\R0402_Phycomp_RC0402.pdf; Author: CERN DEM JLC; CreateDate: 12/3/2007; LatestRevisionDate: 10/17/2012
R28 = R0402_0R_JUMPER: Resistor; Part Description: 1A (0.05R Max DC Resistance) Zero Ohm Jumper; Manufacturer: GENERIC; Manufacturer1 Part Number: 232270591001L; PressFit: No; Part Number: R0402_0R_JUMPER; Component Kind: Standard; Component Type: Standard; Pin Count: 2; Value: 0; Status: Not Recommended; Manufacturer Part Number: R0402_0R_JUMPER; Case: 0402; Mounted: Yes; Sense: No; Socket: No; SMD: Yes; Manufacturer1 Example: YAGEO PHYCOMP; Manufacturer1 ComponentHeight: 0.4mm; HelpURL: \\cern.ch\dfs\Applications\Altium\Datasheets\R0402_Phycomp_RC0402.pdf; Author: CERN DEM JLC; CreateDate: 12/3/2007; LatestRevisionDate: 10/17/2012
R29 R30 = R0603_0R_JUMPER: Resistor; Part Description: 1A (0.05R Max DC Resistance) Zero Ohm Jumper; Manufacturer: GENERIC; Manufacturer1 Part Number: NRC06Z0; PressFit: No; Part Number: R0603_0R_JUMPER; Component Kind: Standard; Component Type: Standard; Pin Count: 2; Value: 0; Status: Preferred; Manufacturer Part Number: R0603_0R_JUMPER; Case: 0603; Mounted: Yes; Sense: No; Socket: No; SMD: Yes; Manufacturer1 Example: NIC COMPONENT; Manufacturer1 ComponentHeight: 0.55mm; HelpURL: \\cern.ch\dfs\Applications\Altium\Datasheets\R0603_NIC_NRC.pdf; Author: CERN DEM JLC; CreateDate: 12/3/2007; LatestRevisionDate: 3/13/2008
R37 R38 R42 = R0402_33R_1%_0.0625W_100PPM: Resistor - 1%; Part Description: General Purpose Thick Film Chip Resistor; Manufacturer: GENERIC; Manufacturer1 Part Number: 232270673309L; TC: ±100ppm/°C; PressFit: No; Part Number: R0402_33R_1%_0.0625W_100PPM; Component Kind: Standard; Component Type: Standard; Pin Count: 2; Value: 33; Status: Not Recommended; Power: 0.0625W; Manufacturer Part Number: R0402_33R_1%_0.0625W_100PPM; Case: 0402; Mounted: Yes; Sense: No; Socket: No; SMD: Yes; Manufacturer1 Example: YAGEO PHYCOMP; Manufacturer1 ComponentHeight: 0.4mm; HelpURL: \\cern.ch\dfs\Applications\Altium\Datasheets\R0402_Phycomp_RC0402.pdf; Author: CERN DEM JLC; CreateDate: 12/3/2007; LatestRevisionDate: 10/17/2012
R39 = R0402_49R9_1%_0.0625W_100PPM: Resistor - 1%; Part Description: General Purpose Thick Film Chip Resistor; Manufacturer: GENERIC; Manufacturer1 Part Number: 232270674999L or RC0402FR-0749R9L; TC: ±100ppm/°C; PressFit: No; Part Number: R0402_49R9_1%_0.0625W_100PPM; Component Kind: Standard; Component Type: Standard; Pin Count: 2; Value: 49R9; Status: Not Recommended; Power: 0.0625W; Manufacturer Part Number: R0402_49R9_1%_0.0625W_100PPM; Case: 0402; Mounted: Yes; Sense: No; Socket: No; SMD: Yes; Manufacturer1 Example: YAGEO PHYCOMP; Manufacturer1 ComponentHeight: 0.4mm; HelpURL: \\cern.ch\dfs\Applications\Altium\Datasheets\R0402_Phycomp_RC0402.pdf; Author: CERN DEM JLC; CreateDate: 10/24/2012; LatestRevisionDate: 10/24/2012
R40 R47 = R0402_5K1_1%_0.0625W_100PPM: Resistor - 1%; Part Description: General Purpose Thick Film Chip Resistor; Manufacturer: GENERIC; Manufacturer1 Part Number: 232270675102L; TC: ±100ppm/°C; PressFit: No; Part Number: R0402_5K1_1%_0.0625W_100PPM; Component Kind: Standard; Component Type: Standard; Pin Count: 2; Value: 5k1; Status: Not Recommended; Power: 0.0625W; Manufacturer Part Number: R0402_5K1_1%_0.0625W_100PPM; Case: 0402; Mounted: Yes; Sense: No; Socket: No; SMD: Yes; Manufacturer1 Example: YAGEO PHYCOMP; Manufacturer1 ComponentHeight: 0.4mm; HelpURL: \\cern.ch\dfs\Applications\Altium\Datasheets\R0402_Phycomp_RC0402.pdf; Author: CERN DEM JLC; CreateDate: 12/3/2007; LatestRevisionDate: 10/17/2012
SW1 SW2 = SW_C&K_JS202011CQN: DPDTSwitch; Part Description: DPDT Vertical Slide Subminiature Switch, Thru-Hole Mount, Contact Rating 300mA 6VDC, JS Series; Manufacturer: C&K; PressFit: No; Part Number: SW_C&K_JS202011CQN; Component Kind: Standard; Component Type: Standard; Pin Count: 6; PackageDescription: Body 9x3.6mm, DPDT Vertical Slide Subminiature Switch, Thru-Hole Mount, JS Series; Family: Switch; Mounted: Yes; Socket: No; SMD: No; Sense: No; Status: None; Manufacturer Part Number: JS202011CQN; ComponentHeight: 3.5mm; HelpURL: \\cern.ch\dfs\Applications\Altium\Datasheets\SW_C&K_JS202011CQN.pdf; Author: CERN DEM MR; CreateDate: 11/13/2019; LatestRevisionDate: 11/13/2019
T1-T4 = BSS138LT1G: N-CHANNEL MOSFET WITH DIODE; Part Description: 50V, 200mA N-Channel Enhancement Mode Field-Effect Transistor; Manufacturer: ON SEMICONDUCTOR; PressFit: No; Bonding: No; Part Number: BSS138LT1G; Component Kind: Standard; Component Type: Standard; Device: BSS138LT1G; PackageDescription: SOT23, 0.95mm Pitch; 3 Pin, 1.40mm W X 3.00mm L X 1.10mm H body, IPC Medium Density; Manufacturer Part Number: BSS138L; Pin Count: 3; Case: SOT23-3; Mounted: Yes; Socket: No; SMD: Yes; Sense: No; ComponentHeight: 1.11mm; HelpURL: \\cern.ch\dfs\Applications\Altium\Datasheets\BSS138LT1G.pdf; Author: CERN DEM JLC; CreateDate: 3/23/2009; LatestRevisionDate: 5/25/2022
TR1 = XFMR_MINI-CIRCUITS_TC1-1+: 50 Ohm 1.5 To 500MHz RF Transformers; Part Description: 50 Ohms 1.5 to 500 MHz RF Transformer; Manufacturer Part Number: TC1-1+; Part Number: XFMR_MINI-CIRCUITS_TC1-1+; Component Kind: Standard; Component Type: Standard; Pin Count: 5; Value: 1:1; Status: None; Manufacturer: MINI-CIRCUITS; Mounted: Yes; Socket: No; Sense: No; SMD: Yes; ComponentHeight: 4.06mm; HelpURL: \\cern.ch\dfs\Applications\Altium\Datasheets\XFMR_MINI-CIRCUITS_TC1-1+.pdf; Author: CERN DEM JLC; CreateDate: 2/8/2010; LatestRevisionDate: 4/27/2010

## Assembly variants
Default: not fitted C34 R? R? R? R? R?